# EasyEDA schematic 1056-Codarl_2021-05-07.json
TITLE: 1056-Codarl; REV: 6.9; Date: 2021-05-06; Sheet: 1/1; Company: Zarek Industrial
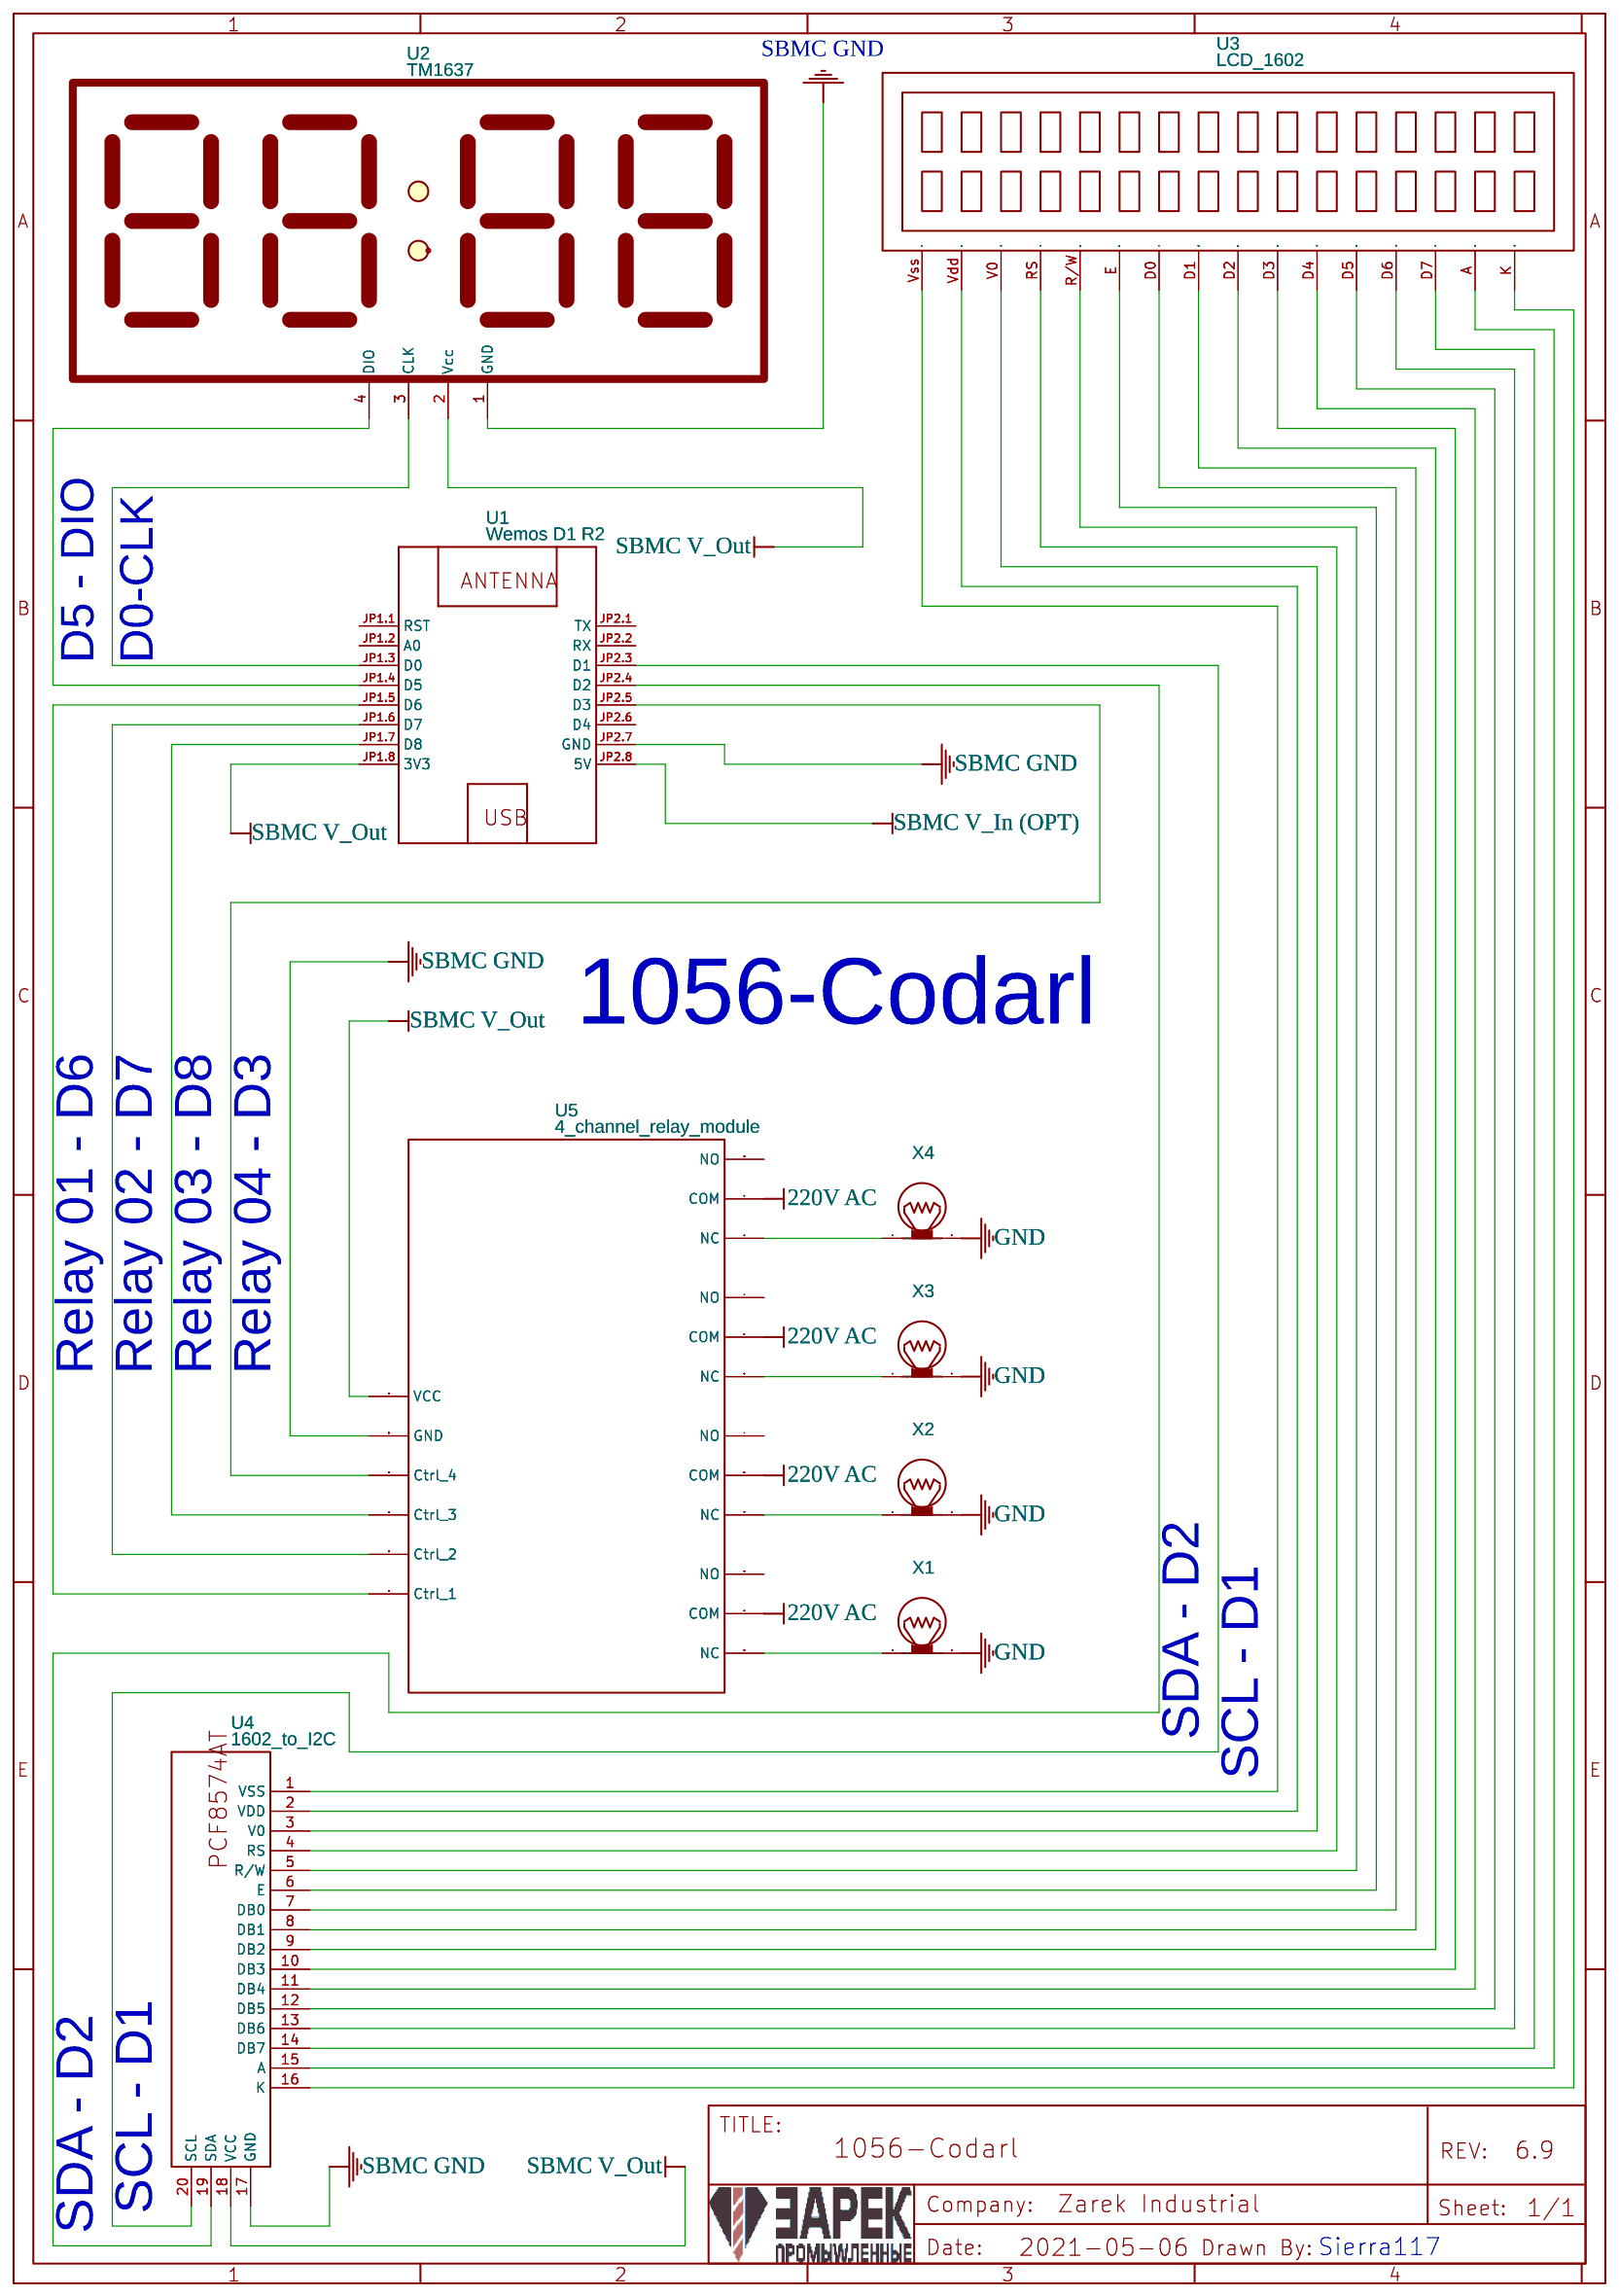
[diagram p0: schematic sheet]

## Parts
U1  Wemos D1 R2
U2  TM1637
U3  LCD_1602
U4  1602_to_I2C
U5  4_channel_relay_module
X1  Lamp
X2  Lamp
X3  Lamp
X4  Lamp

## Library data of the parts
U1 = Wemos: catid: 20; Contributor: evc5617; Manufacturer Part: wemos d1; Supplier Part: wemos d1; sim: true
U2 = -: Contributor: daniel.carcereri
U3 = LCD_1602: catid: 20; Contributor: Tadeáš Zajíček (q)
U4 = 1602_to_I2C: catid: 20; Contributor: kiseev.nikolay; Manufacturer Part: Converter 1602-to-I2C; sim: true
U5 = 4_channel_relay_module: Contributor: Guest
X1-X4 = LAMP: catid: 20; Dropout Voltage: 12; Power: 10; Contributor: EasyEDA; NameDisplay: 0

## Nets
220V AC: U5.2(COM) U5.5(COM) U5.8(COM) U5.11(COM)
GND: X1.2 X2.2 X3.2 X4.2
SBMC GND: U1.JP2.7(GND) U2.1(GND) U4.17(GND) U5.16(GND)
SBMC V_In (OPT): U1.JP2.8(5V)
SBMC V_Out: U1.JP1.8(3V3) U2.2(Vcc) U4.18(VCC) U5.15(VCC)
Net-(U1-JP1.3): U1.JP1.3(D0) U2.3(CLK)
Net-(U1-JP1.4): U1.JP1.4(D5) U2.4(DIO)
Net-(U1-JP1.5): U1.JP1.5(D6) U1.JP1.6(D7) U5.19(Ctrl 1)
Net-(U1-JP1.7): U1.JP1.7(D8) U5.18(Ctrl 3)
Net-(U1-JP2.3): U1.JP2.3(D1) U4.20(SCL)
Net-(U1-JP2.4): U1.JP2.4(D2) U4.19(SDA)
Net-(U1-JP2.5): U1.JP2.5(D3) U5.17(Ctrl 4)
Net-(U3-A): U3.A(15) U4.15(A)
Net-(U3-D0): U3.D0(7) U4.7(DB0)
Net-(U3-D1): U3.D1(8) U4.8(DB1)
Net-(U3-D2): U3.D2(9) U4.9(DB2)
Net-(U3-D3): U3.D3(10) U4.10(DB3)
Net-(U3-D4): U3.D4(11) U4.11(DB4)
Net-(U3-D5): U3.D5(12) U4.12(DB5)
Net-(U3-D6): U3.D6(13) U4.13(DB6)
Net-(U3-D7): U3.D7(14) U4.14(DB7)
Net-(U3-E): U3.E(6) U4.6(E)
Net-(U3-K): U3.K(16) U4.16(K)
Net-(U3-R/W): U3.R/W(5) U4.5(R/W)
Net-(U3-RS): U3.RS(4) U4.4(RS)
Net-(U3-V0): U3.V0(3) U4.3(V0)
Net-(U3-Vdd): U3.Vdd(2) U4.2(VDD)
Net-(U3-Vss): U3.Vss(1) U4.1(VSS)
Net-(U5-3): U5.3(NC) X4.1
Net-(U5-6): U5.6(NC) X3.1
Net-(U5-9): U5.9(NC) X2.1
Net-(U5-12): U5.12(NC) X1.1

Not connected (* = marked no-connect by the designer): U1 JP1.1(RST) JP1.2(A0) JP2.1(TX) JP2.2(RX) JP2.6(D4); U5 4(NO) 7(NO) 10(NO) NO

## Notes on the sheet
- D5 - DIO
- D0-CLK
- 1056-Codarl
- Relay 01 - D6
- Relay 02 - D7
- Relay 03 - D8
- Relay 04 - D3
- SDA - D2
- SCL - D1
- SCL - D1
- SDA - D2
- Sierra117
